# EAGLE design h2oiq_v2 (EAGLE 6.3)
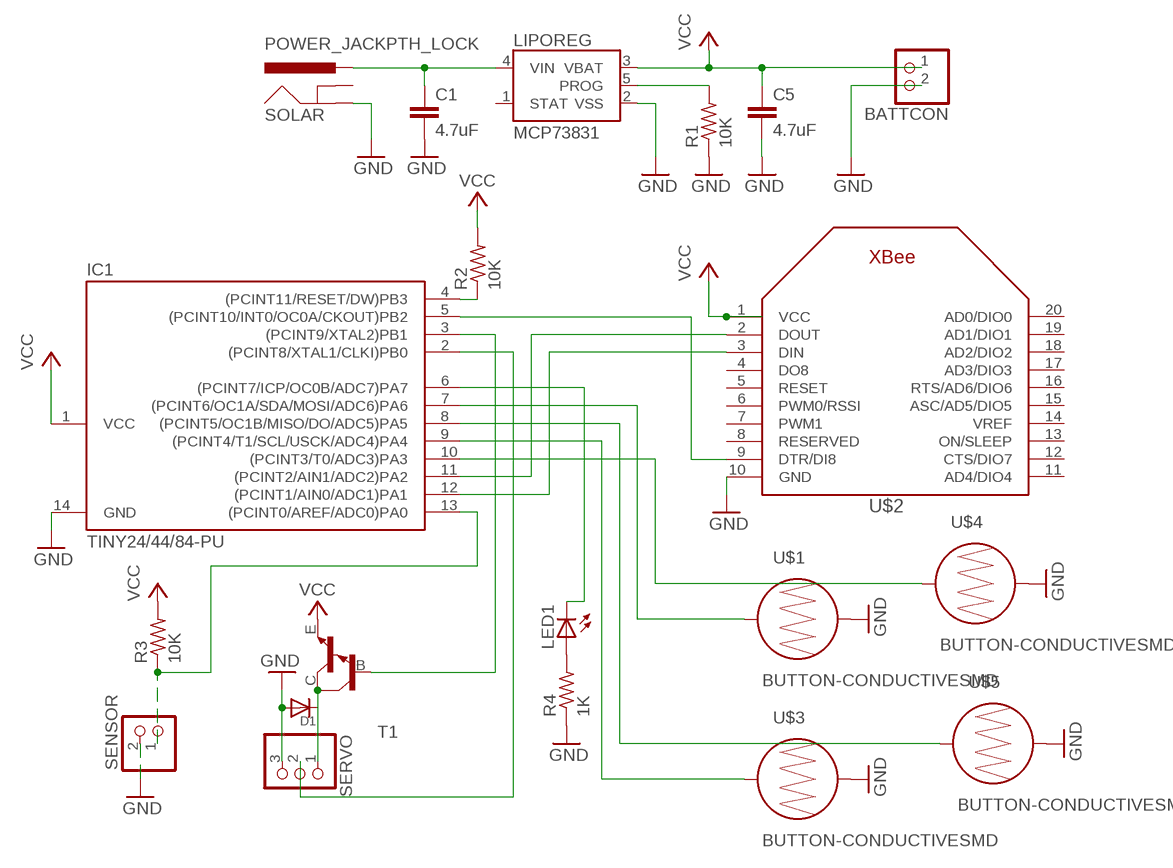
[diagram p0: schematic, sheet 1]

## Parts
BATTCON  JST_2PIN-SMT  [JST-PH-2-SMT]
C1  4.7uF  CAP0402-CAP  [0402-CAP]
C5  4.7uF  CAP0402-CAP  [0402-CAP]
D1  DIODESMA  [SMADIODE]
IC1  TINY24/44/84-PU  [DIL14]
LED1  LED5MM  [LED5MM]
LIPOREG  MCP73831  [SOT23-5]
R1  10K  R-US_M1206  [M1206]
R2  10K  R-US_M1206  [M1206]
R3  10K  R-US_M1206  [M1206]
R4  1K  R-US_M1206  [M1206]
SENSOR  JST_2PIN-SMT  [JST-PH-2-SMT]
SERVO  PINHD-1X3CB  [1X03-CLEANBIG]
SOLAR  POWER_JACKPTH_LOCK  [POWER_JACK_PTH_LOCK]
T1  MMBTA13LT1-NPN_DARL-SOT23-BEC  [SOT23-BEC]
U$1  BUTTON-CONDUCTIVESMD  [BUTTON-CONDUCTIVE]
U$2  XBEE  [XBEE]
U$3  BUTTON-CONDUCTIVESMD  [BUTTON-CONDUCTIVE]
U$4  BUTTON-CONDUCTIVESMD  [BUTTON-CONDUCTIVE]
U$5  BUTTON-CONDUCTIVESMD  [BUTTON-CONDUCTIVE]

## Nets
GND: BATTCON.2 C1.2 C5.2 D1.A IC1.14(GND) LIPOREG.2(VSS) R1.1 R4.1 SENSOR.2 SERVO.3 SOLAR.GND U$1.2 U$2.10(GND) U$3.2 U$4.2 U$5.2
N$1: C1.1 LIPOREG.4(VIN) SOLAR.PWR
N$2: LIPOREG.5(PROG) R1.2
N$3: IC1.4((PCINT11/RESET/DW)PB3) R2.1
N$4: IC1.3((PCINT9/XTAL2)PB1) T1.B
N$5: D1.C SERVO.1 T1.C
N$6: IC1.5((PCINT10/INT0/OC0A/CKOUT)PB2) U$2.9(DTR/DI8)
N$7: IC1.11((PCINT2/AIN1/ADC2)PA2) U$2.2(DOUT)
N$8: IC1.12((PCINT1/AIN0/ADC1)PA1) U$2.3(DIN)
N$9: IC1.13((PCINT0/AREF/ADC0)PA0) R3.1 SENSOR.1
N$10: IC1.2((PCINT8/XTAL1/CLKI)PB0) SERVO.2
N$11: LED1.A R4.2
N$12: IC1.6((PCINT7/ICP/OC0B/ADC7)PA7) LED1.K(C)
N$18: IC1.7((PCINT6/OC1A/SDA/MOSI/ADC6)PA6) U$1.1
N$19: IC1.10((PCINT3/T0/ADC3)PA3) U$4.1
N$20: IC1.8((PCINT5/OC1B/MISO/DO/ADC5)PA5) U$5.1
N$21: IC1.9((PCINT4/T1/SCL/USCK/ADC4)PA4) U$3.1
VCC: BATTCON.1 C5.1 IC1.1(VCC) LIPOREG.3(VBAT) R2.2 R3.2 T1.E U$2.1(VCC)
Unconnected: LIPOREG.1(STAT) SOLAR.GNDBREAK U$2.4(DO8) U$2.5(RESET) U$2.6(PWM0/RSSI) U$2.7(PWM1) U$2.8(RESERVED) U$2.11(AD4/DIO4) U$2.12(CTS/DIO7) U$2.13(ON/SLEEP) U$2.14(VREF) U$2.15(ASC/AD5/DIO5) U$2.16(RTS/AD6/DIO6) U$2.17(AD3/DIO3) U$2.18(AD2/DIO2) U$2.19(AD1/DIO1) U$2.20(AD0/DIO0)

## Library data of the parts
BATTCON SENSOR = adafruit:JST_2PIN: JST 2-Pin Connectors of various flavors SMT-RA (S2B-PH-SM4) 4UConnector #17311 SMT (B2B-PH-SM4) THM-RA (S2B-PH) THM (B2B-PH)
C1 C5 = SparkFun:CAP: Capacitor Standard 0603 ceramic capacitor, and 0.1" leaded capacitor.
D1 = adafruit:DIODE: Diode SMADIODE - SMA Surface Mount Package 20V 1A Schottky Diode Digikey: 641-1014-6-ND DO-1N4148 - Through Hole Small Current Diode SOD-123 20V 1 A (.5mV Vf) Schottky Diode - Digikey: MBRX120TPMSCT-ND SOD-323 10V 570mA (.38mV Vf, 3ns) Schottky Diode - Digikey: ZLLS410CT-ND SOD-523 30V 30mA Schottky Diode (RB751S-40TE61) - Digikey: RB751S-40TE61CT-ND SOT23-R/W - SOT23 Package (R = Solder Paste/Reflow Ovens, W = Hand-Soldering) BAT54Film 40V 300mA - Digikey: 497-7162-1-ND
IC1 = avr-7:TINY24/44/84
LED1 = adafruit:LED: LED OSRAM: - CHIPLED LG R971, LG N971, LY N971, LG Q971, LY Q971, LO R971, LY R971 LH N974, LH R974 LS Q976, LO Q976, LY Q976 LO Q996 - Hyper CHIPLED LW Q18S LB Q993, LB Q99A, LB R99A - SideLED LS A670, LO A670, LY A670, LG A670, LP A670 LB A673, LV A673, LT A673, LW A673 LH A674 LY A675 LS A676, LA A676, LO A676, LY A676, LW A676 LS A679, LY A679, LG A679 - Hyper Micro SIDELED® LS Y876, LA Y876, LO Y876, LY Y876 LT Y87S - SmartLED LW L88C, LW L88S LB L89C, LB L89S, LG L890 LS L89K, LO L89K, LY L89K LS L896, LA L896, LO L896, LY L896 - TOPLED LS T670, LO T670, LY T670, LG T670, LP T670 LSG T670, LSP T670, LSY T670, LOP T670, LYG T670 LG T671, LOG T671, LSG T671 LB T673, LV T673, LT T673, LW T673 LH T674 LS T676, LA T676, LO T676, LY T676, LB T676, LH T676, LSB T676, LW T676 LB T67C, LV T67C, LT T67C, LS T67K, LO T67K, LY T67K, LW E67C LS E67B, LA E67B, LO E67B, LY E67B, LB E67C, LV E67C, LT E67C LW T67C LS T679, LY T679, LG T679 LS T770, LO T770, LY T770, LG T770, LP T770 LB T773, LV T773, LT T773, LW T773 LH T774 LS E675, LA E675, LY E675, LS T675 LS T776, LA T776, LO T776, LY T776, LB T776 LHGB T686 LT T68C, LB T68C - Hyper Mini TOPLED® LB M676 - Mini TOPLED Santana® LG M470 LS M47K, LO M47K, LY M47K Source: http://www.osram.convergy.de/
LIPOREG = SparkFun:MCP73831: Microchip's MCP73831 Miniature single cell, fully integrated Li-Ion, Li-polymer charge management controller http://ww1.microchip.com/downloads/en/DeviceDoc/21984a.pdf
R1-R4 = rcl:R-US_: RESISTOR, American symbol
SERVO = adafruit:PINHD-1X3: PIN HEADER
SOLAR = SparkFun:POWER_JACK: Power Jack This is the standard 5.5mm barrel jack for power. The PTH is the most common, proven, reliable, footprint. All others are experimental. The Slot footprint only works if the mill layer is transmitted to the PCB fab house so be warned. Spark Fun Electronics SKU : PRT-00119. Mating wall wart : TOL-00298 (and others)
T1 = transistor:*-NPN_DARL-: NPN Darlington Transistor
U$1 U$3-U$5 = SparkFun:BUTTON-CONDUCTIVE: Conductive Button Used with rubber key pads. This one was designed and proven to work with the PolyCase Key FOB enclosures.
U$2 = adafruit:XBEE

## Board
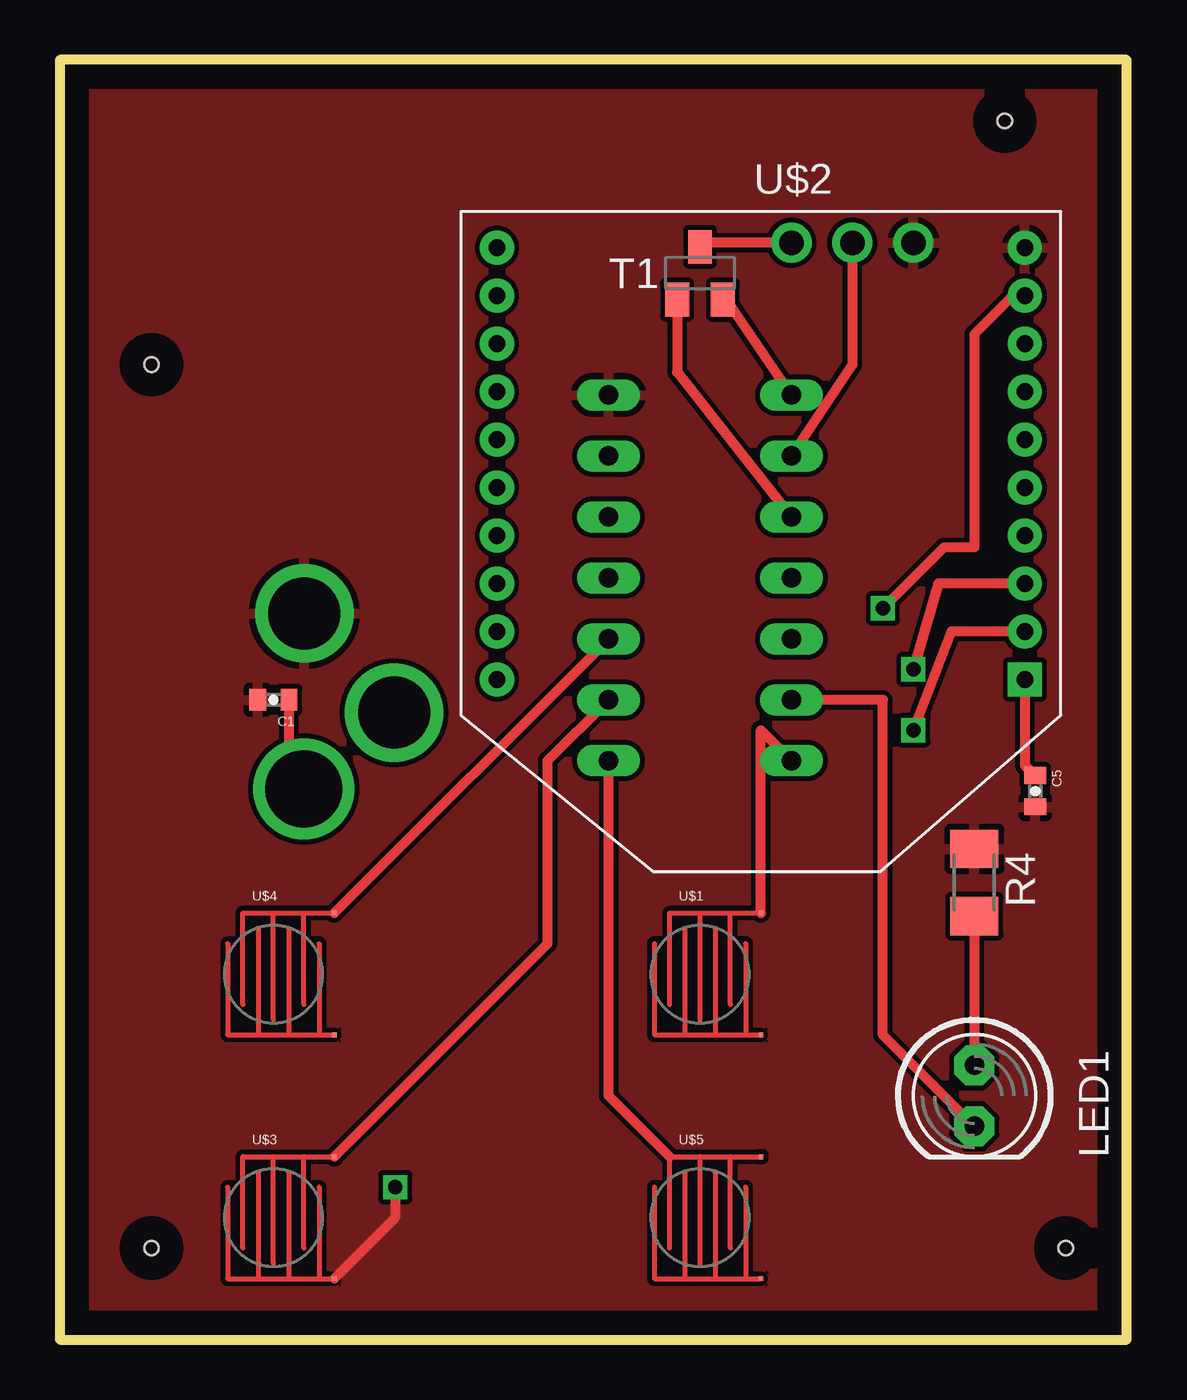
[diagram p1: board, top side]
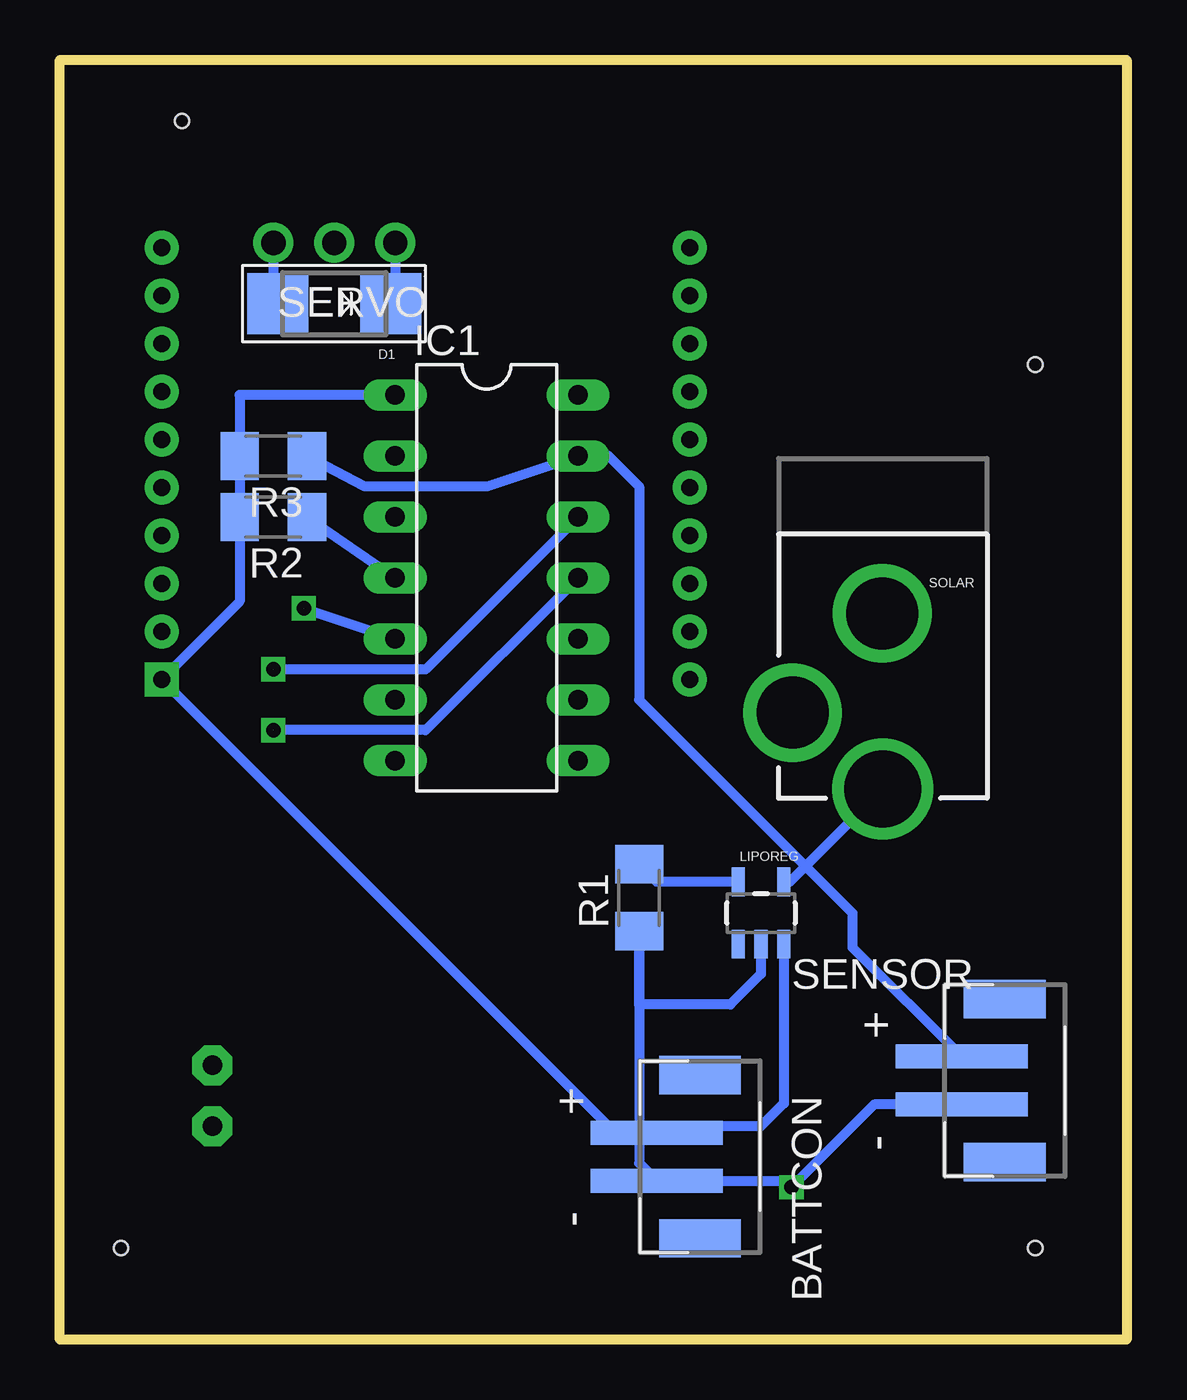
[diagram p2: board, bottom side, seen from below]

Size 44.45 x 53.34 mm. Coordinates in mm from the lower left corner, seen from the top.
Outline: 0,0 44.45,0 44.45,53.34 0,53.34 0,0
Copper layers (1*16): Top 0.035mm / dielectric 1.5mm / Bottom 0.035mm
Design rules "default": minimum track width 10mil, minimum drill 24mil, track to track 8mil, track to pad 8mil, pad to pad 8mil, via to via 8mil, smd to smd 8mil, copper to edge 40mil, drill to drill 8mil, minimum pad ring 10mil, minimum via ring 8mil, stop-mask expansion 4mil, vias tented up to drill 0mil, thermal gap 10mil
Holes 0.6 mm at 3.81,40.64 39.37,50.8 3.81,3.81 41.91,3.81

### Footprints (pad centres in the part's own frame; a part is rotated, then mirrored left to right if it is on the bottom)
JST-PH-2-SMT = smd 1 x 5.5: 1 -1,-1.8; 2 1,-1.8 | smd 1.6 x 3.4: NC1 -3.4,0; NC2 3.4,0
0402-CAP = smd 0.7 x 0.9: 1 -0.65,0; 2 0.65,0
SMADIODE = smd 2.54 x 2.54: A 2.349,0; C -2.349,0
DIL14 = drill 0.813 long: 1 -7.62,-3.81; 2 -5.08,-3.81; 3 -2.54,-3.81; 4 0,-3.81; 5 2.54,-3.81; 6 5.08,-3.81; 7 7.62,-3.81; 8 7.62,3.81; 9 5.08,3.81; 10 2.54,3.81; 11 0,3.81; 12 -2.54,3.81; 13 -5.08,3.81; 14 -7.62,3.81
LED5MM = drill 0.813 pad 1.676 octagon: A -1.27,0; K 1.27,0
SOT23-5 = smd 0.55 x 1.2: 1 -0.95,-1.3; 2 0,-1.3; 3 0.95,-1.3; 4 0.95,1.3; 5 -0.95,1.3
M1206 = smd 1.6 x 2: 1 -1.4,0; 2 1.4,0
1X03-CLEANBIG = drill 1.016 pad 1.676: 1 -2.54,0; 2 0,0; 3 2.54,0
POWER_JACK_PTH_LOCK = drill 2.997 pad 4.115: GND 0.025,6.557; GNDBREAK 3.762,10.7 | drill 3.2 pad 4.115: PWR 0,13.878
SOT23-BEC = smd 1 x 1.4: B -0.95,-1.1; C 0,1.1; E 0.95,-1.1
BUTTON-CONDUCTIVE = smd 0.203 x 0.203: 1 2.54,2.54; 2 2.54,-2.54
XBEE = drill 0.7 pad 1.422 square: 1 -11,5.5 | drill 0.7 pad 1.422: 2 -11,3.5; 3 -11,1.5; 4 -11,-0.5; 5 -11,-2.5; 6 -11,-4.5; 7 -11,-6.5; 8 -11,-8.5; 9 -11,-10.5; 10 -11,-12.5; 11 11,-12.5; 12 11,-10.5; 13 11,-8.5; 14 11,-6.5; 15 11,-4.5; 16 11,-2.5; 17 11,-0.5; 18 11,1.5; 19 11,3.5; 20 11,5.5

### Placement (x,y rotation side)
BATTCON  17.78,7.62 270 bottom
C1  8.89,26.67 180 top
C5  40.64,22.86 270 top
D1  33.02,43.18 180 bottom
IC1  26.67,31.75 270 bottom
LED1  38.1,10.16 270 top
LIPOREG  15.24,17.78 0 bottom
R1  20.32,18.41 90 bottom
R2  35.56,34.29 180 bottom
R3  35.56,36.83 180 bottom
R4  38.1,19.05 270 top
SENSOR  5.08,10.79 270 bottom
SERVO  33.02,45.72 180 bottom
SOLAR  10.16,36.83 180 bottom
T1  26.67,44.45 0 top
U$1  26.67,15.24 0 top
U$2  29.21,33.02 180 top
U$3  8.89,5.08 0 top
U$4  8.89,15.24 0 top
U$5  26.67,5.08 0 top

### Tracks (layer width: path | path; a pad name or v marks a point on that pad's centre or on a via)
GND  (via drill 0.6)
  Top 0.406: v13.97,6.35 13.97,5.08 U$3.2
  Bottom 0.406: SERVO.3 35.56,43.37 D1.A | LIPOREG.2 15.24,15.24 16.51,13.97 20.32,13.97 R1.1 20.32,7.36 BATTCON.2 14.24,6.62 v13.97,6.35 10.53,9.79 SENSOR.2
  pour Top: -1.27,54.61 -1.27,-1.27 45.72,-1.27 45.72,54.61
N$1
  Top 0.406: C1.1 9.54,23.57 SOLAR.PWR
  Bottom 0.406: LIPOREG.4 14.03,19.08 SOLAR.PWR
N$2
  Bottom 0.406: LIPOREG.5 19.59,19.08 R1.2
N$3
  Bottom 0.406: R2.1 IC1.4
N$4
  Top 0.406: T1.B 25.72,40.32 IC1.3
N$5
  Top 0.406: SERVO.1 26.84,45.72 T1.C
  Bottom 0.406: SERVO.1 30.48,43.37 D1.C
N$6  (1 unrouted)
  Top 0.406: U$2.9 39.71,43.52 38.1,41.91 38.1,33.02 36.83,33.02 34.29,30.48
  Bottom 0.406: IC1.5 34.29,30.48
N$7  (1 unrouted)
  Top 0.406: U$2.2 37.14,29.52 35.56,25.4
  Bottom 0.406: IC1.11 29.21,25.4 35.56,25.4
N$8  (1 unrouted)
  Top 0.406: U$2.3 36.6,31.52 35.56,27.94
  Bottom 0.406: IC1.12 29.21,27.94 35.56,27.94
N$9
  Bottom 0.406: R3.1 31.75,35.56 26.67,35.56 IC1.13 21.59,36.83 20.32,35.56 20.32,26.67 11.43,17.78 11.43,16.34 SENSOR.1
N$10
  Top 0.406: SERVO.2 33.02,40.64 IC1.2
N$11
  Top 0.406: R4.2 LED1.A
N$12
  Top 0.406: LED1.K 34.29,12.7 34.29,26.67 IC1.6
N$16  (via drill 0.6)
  other vias: 34.29,30.48
N$17  (via drill 0.6)
  other vias: 35.56,27.94
N$18
  Top 0.406: U$1.1 29.21,25.4 IC1.7
N$19
  Top 0.406: IC1.10 U$4.1
N$20
  Top 0.406: 25.4,7.62 22.86,10.16 IC1.8
N$21
  Top 0.406: U$3.1 20.32,16.51 20.32,24.13 IC1.9
N$22  (via drill 0.6)
  other vias: 35.56,25.4
N$23  (via drill 0.6)
  other vias: 13.97,6.35
VCC
  Top 0.406: U$2.1 40.21,23.94 C5.1 | T1.E 27.77,43.35 IC1.1
  Bottom 0.406: IC1.1 36.96,39.37 R3.2 R2.2 36.96,30.77 U$2.1 21.31,8.62 BATTCON.1 19.31,8.89 15.24,8.89 14.29,9.84 LIPOREG.3